# Altium schematic sheet pa_main.SchDoc: mcHF Pro Transceiver RF board
size A3; Author: Krassi Atanassov; CompanyName: MØNKA; Engineer: For radio amateurs experimentation, non-commercial use only. Thank you!; Revision: 0.8.2; SheetTotal: 14
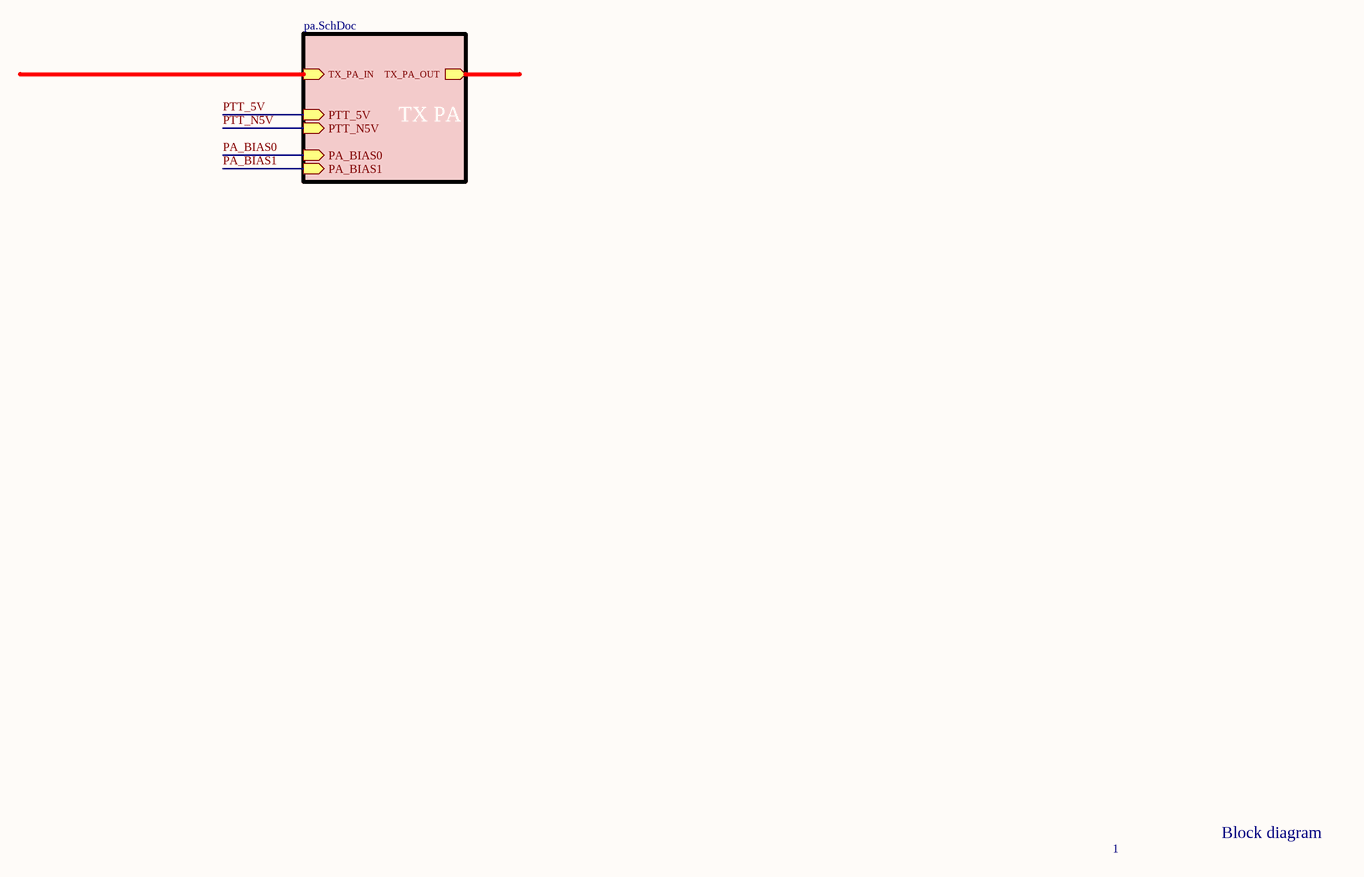
[diagram p0: pa_main.SchDoc]

## Sub-sheets
TX PA = pa.SchDoc: TX_PA_IN (in), PA_BIAS0 (in), TX_PA_OUT (out), PTT_N5V (in), PTT_5V (in), PA_BIAS1 (in)

## Nets
PA_BIAS0: sheet TX PA/PA_BIAS0
PA_BIAS1: sheet TX PA/PA_BIAS1
PTT_5V: sheet TX PA/PTT_5V
PTT_N5V: sheet TX PA/PTT_N5V

## Notes on the sheet
- 1
- Block diagram
- Date:
- File:
- Revision:
- Sheet
- of
- Licence: